# EAGLE schematic AddMixShift (EAGLE 7.7.0)
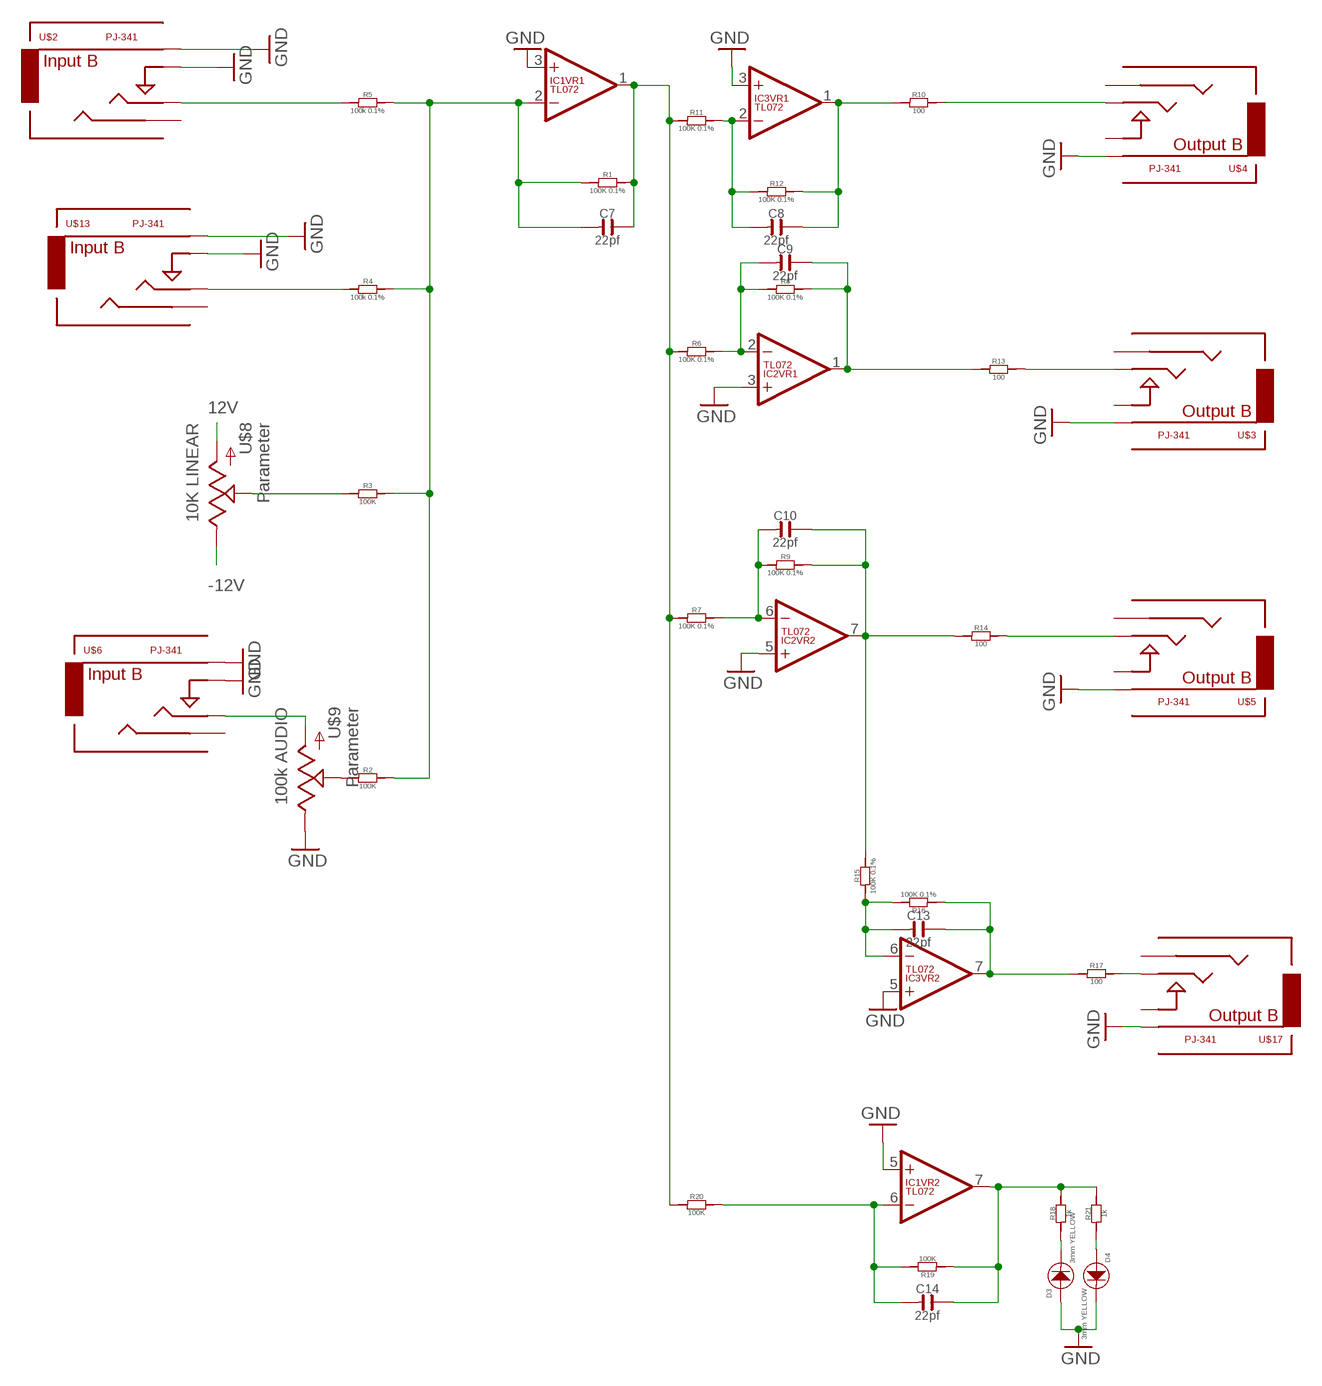
[diagram p0: schematic, sheet 1, part 1 of 2]
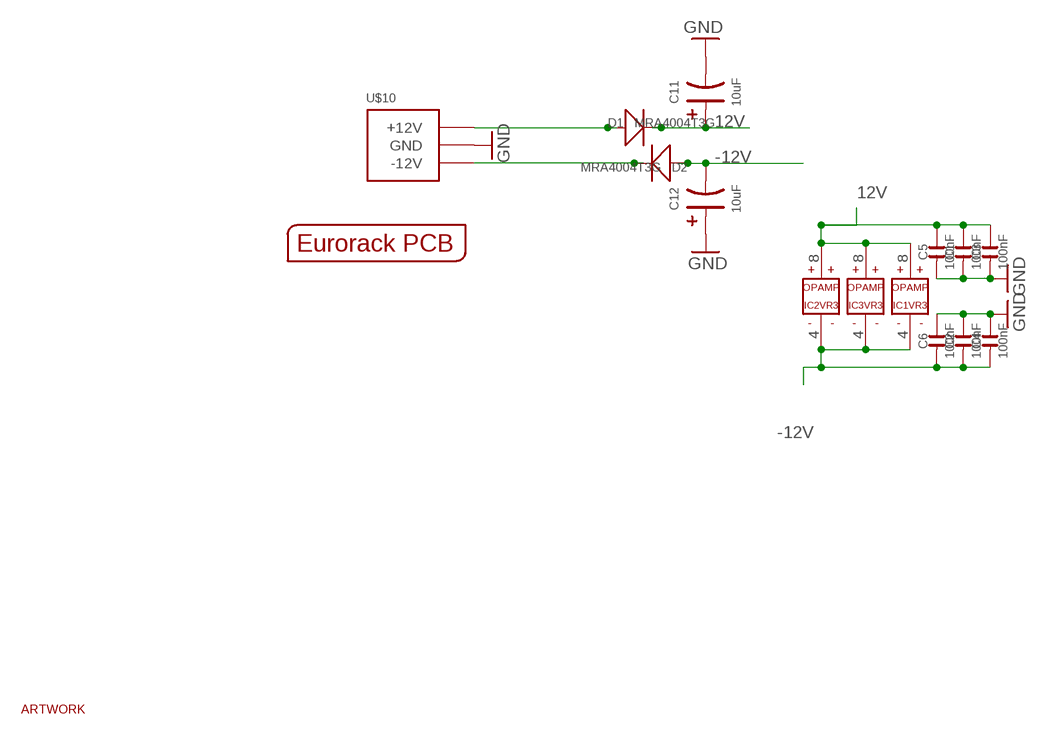
[diagram p1: schematic, sheet 1, part 2 of 2]

## Parts
C1  100nF  C-0603  [C0603]
C2  100nF  C-0603  [C0603]
C3  100nF  C-0603  [C0603]
C4  100nF  C-0603  [C0603]
C5  100nF  C-0603  [C0603]
C6  100nF  C-0603  [C0603]
C7  22pf  C-0603  [C0603]
C8  22pf  C-0603  [C0603]
C9  22pf  C-0603  [C0603]
C10  22pf  C-0603  [C0603]
C11  10uF  C-POLAR-A  [AVX-A]
C12  10uF  C-POLAR-A  [AVX-A]
C13  22pf  C-0603  [C0603]
C14  22pf  C-0603  [C0603]
D1  MRA4004T3G  D-SMA  [DO-214AC]
D2  MRA4004T3G  D-SMA  [DO-214AC]
D3  3mm YELLOW  LED3MM  [3MMLED]
D4  3mm YELLOW  LED3MM  [3MMLED]
IC1  TL072  [SO08]
IC2  TL072  [SO08]
IC3  TL072  [SO08]
R1  100K 0.1%  R-0603  [R0603]
R2  100K  R-0603  [R0603]
R3  100K  R-0603  [R0603]
R4  100k 0.1%  R-0603  [R0603]
R5  100k 0.1%  R-0603  [R0603]
R6  100K 0.1%  R-0603  [R0603]
R7  100K 0.1%  R-0603  [R0603]
R8  100K 0.1%  R-0603  [R0603]
R9  100K 0.1%  R-0603  [R0603]
R10  100  R-0603  [R0603]
R11  100K 0.1%  R-0603  [R0603]
R12  100K 0.1%  R-0603  [R0603]
R13  100  R-0603  [R0603]
R14  100  R-0603  [R0603]
R15  100K 0.1%  R-0603  [R0603]
R16  100K 0.1%  R-0603  [R0603]
R17  100  R-0603  [R0603]
R18  1k  R-0603  [R0603]
R19  100K  R-0603  [R0603]
R20  100K  R-0603  [R0603]
R21  1k  R-0603  [R0603]
U$1  EURORACK_PCB4HP  [EURORACK4HPPCB]
U$2  PJ-341  AUDIO-JACKINPUT  [3.5MM-JACK-SWITCH-13MM-INPUT]
U$3  PJ-341  AUDIO-JACKOUTPUT  [3.5MM-JACK-SWITCH-13MM-OUTPUT]
U$4  PJ-341  AUDIO-JACKOUTPUT  [3.5MM-JACK-SWITCH-13MM-OUTPUT]
U$5  PJ-341  AUDIO-JACKOUTPUT  [3.5MM-JACK-SWITCH-13MM-OUTPUT]
U$6  PJ-341  AUDIO-JACKINPUT  [3.5MM-JACK-SWITCH-13MM-INPUT]
U$8  10K LINEAR  POTZEPHPOT  [OG-POTS_ALPS_POT_VERTICAL]
U$9  100k AUDIO  POTZEPHPOT  [OG-POTS_ALPS_POT_VERTICAL]
U$10  POWER_SIMPLE  [2X05_SMT_HEADER]
U$11  TINRS_ARTWORKROCKET  [TINRS_ROCKET]
U$13  PJ-341  AUDIO-JACKINPUT  [3.5MM-JACK-SWITCH-13MM-INPUT]
U$17  PJ-341  AUDIO-JACKOUTPUT  [3.5MM-JACK-SWITCH-13MM-OUTPUT]

## Nets
12V: C1.2 C3.2 C5.2 C11.+ D1.2(-) IC1.8(VR3:V+) IC2.8(VR3:V+) IC3.8(VR3:V+) U$8.P$3(A)
-12V: C2.1 C4.1 C6.1 C12.- D2.1(+) IC1.4(VR3:V-) IC2.4(VR3:V-) IC3.4(VR3:V-) U$8.P$1(E)
GND: C1.1 C2.2 C3.1 C4.2 C5.1 C6.2 C11.- C12.+ D3.+ D4.- IC1.3(VR1:+IN) IC1.5(VR2:+IN) IC2.3(VR1:+IN) IC2.5(VR2:+IN) IC3.3(VR1:+IN) IC3.5(VR2:+IN) U$2.RING@3(RING) U$2.SWITCH@3(SWITCH) U$3.RING@3(RING) U$4.RING@3(RING) U$5.RING@3(RING) U$6.RING@3(RING) U$6.SWITCH@3(SWITCH) U$9.P$1(E) U$10.3(GND) U$10.4(GND) U$10.5(GND) U$10.6(GND) U$10.7(GND) U$10.8(GND) U$13.RING@3(RING) U$13.SWITCH@3(SWITCH) U$17.RING@3(RING)
N$1: R2.1 U$9.P$2(S)
N$2: C8.2 IC3.1(VR1:OUT) R10.1 R12.2
N$4: U$6.TIP@3(TIP) U$9.P$3(A)
N$5: C9.1 IC2.2(VR1:-IN) R6.2 R8.1
N$6: R3.1 U$8.P$2(S)
N$7: C7.2 IC1.1(VR1:OUT) R1.2 R6.1 R7.1 R11.1 R20.1
N$8: C8.1 IC3.2(VR1:-IN) R11.2 R12.1
N$9: C10.1 IC2.6(VR2:-IN) R7.2 R9.1
N$11: C9.2 IC2.1(VR1:OUT) R8.2 R13.1
N$12: R4.1 U$13.TIP@3(TIP)
N$13: C10.2 IC2.7(VR2:OUT) R9.2 R14.1 R15.2
N$14: C7.1 IC1.2(VR1:-IN) R1.1 R2.2 R3.2 R4.2 R5.2
N$15: R13.2 U$3.TIP@3(TIP)
N$16: R14.2 U$5.TIP@3(TIP)
N$17: C13.1 IC3.6(VR2:-IN) R15.1 R16.2
N$18: C13.2 IC3.7(VR2:OUT) R16.1 R17.1
N$19: R17.2 U$17.TIP@3(TIP)
N$20: R5.1 U$2.TIP@3(TIP)
N$21: D4.+ R21.1
N$22: R10.2 U$4.TIP@3(TIP)
N$23: D3.- R18.1
N$24: C14.2 IC1.7(VR2:OUT) R18.2 R19.1 R21.2
N$25: C14.1 IC1.6(VR2:-IN) R19.2 R20.2
N$28 [heavypower]: D1.1(+) U$10.9(+12V) U$10.10(+12V)
N$64 [heavypower]: D2.2(-) U$10.1(-12V) U$10.2(-12V)
Unconnected: U$2.SECOND@3(SECOND) U$3.SECOND@3(SECOND) U$3.SWITCH@3(SWITCH) U$4.SECOND@3(SECOND) U$4.SWITCH@3(SWITCH) U$5.SECOND@3(SECOND) U$5.SWITCH@3(SWITCH) U$6.SECOND@3(SECOND) U$13.SECOND@3(SECOND) U$17.SECOND@3(SECOND) U$17.SWITCH@3(SWITCH)

## Library data of the parts
C1-C10 C13 C14 = OPL:C*
C11 C12 = EurorackModularParts:C-POLAR*
D1 D2 = OPL:D*: DIODE; MF: VISHAY; MPN: US1G-E3/5AT; OC_FARNELL: 9551824
D3 D4 = EurorackModularParts:LED*: LED
IC1-IC3 = EurorackModularParts:TL072
R1-R21 = OPL:R*
U$1 = EurorackModularParts:EURORACK_PCB
U$2 U$6 U$13 = EurorackModularParts:AUDIO-JACK: Switching Mono 3.5mm Audio Jack from Erthenvar.; DESC: Input B; MPN: PJ-341
U$3-U$5 U$17 = EurorackModularParts:AUDIO-JACK: Switching Mono 3.5mm Audio Jack from Erthenvar.; DESC: Output B; MPN: PJ-341
U$8 U$9 = EurorackModularParts:POT; DESC: Parameter
U$10 = EurorackModularParts:POWER_SIMPLE
U$11 = EurorackModularParts:TINRS_ARTWORK

## Net classes
0 default: width 0.254 mm
1 heavypower: width 0.381 mm